# Altium schematic sheet CONNECTORS.SchDoc
size A3; SheetNumber: 3; SheetTotal: 4
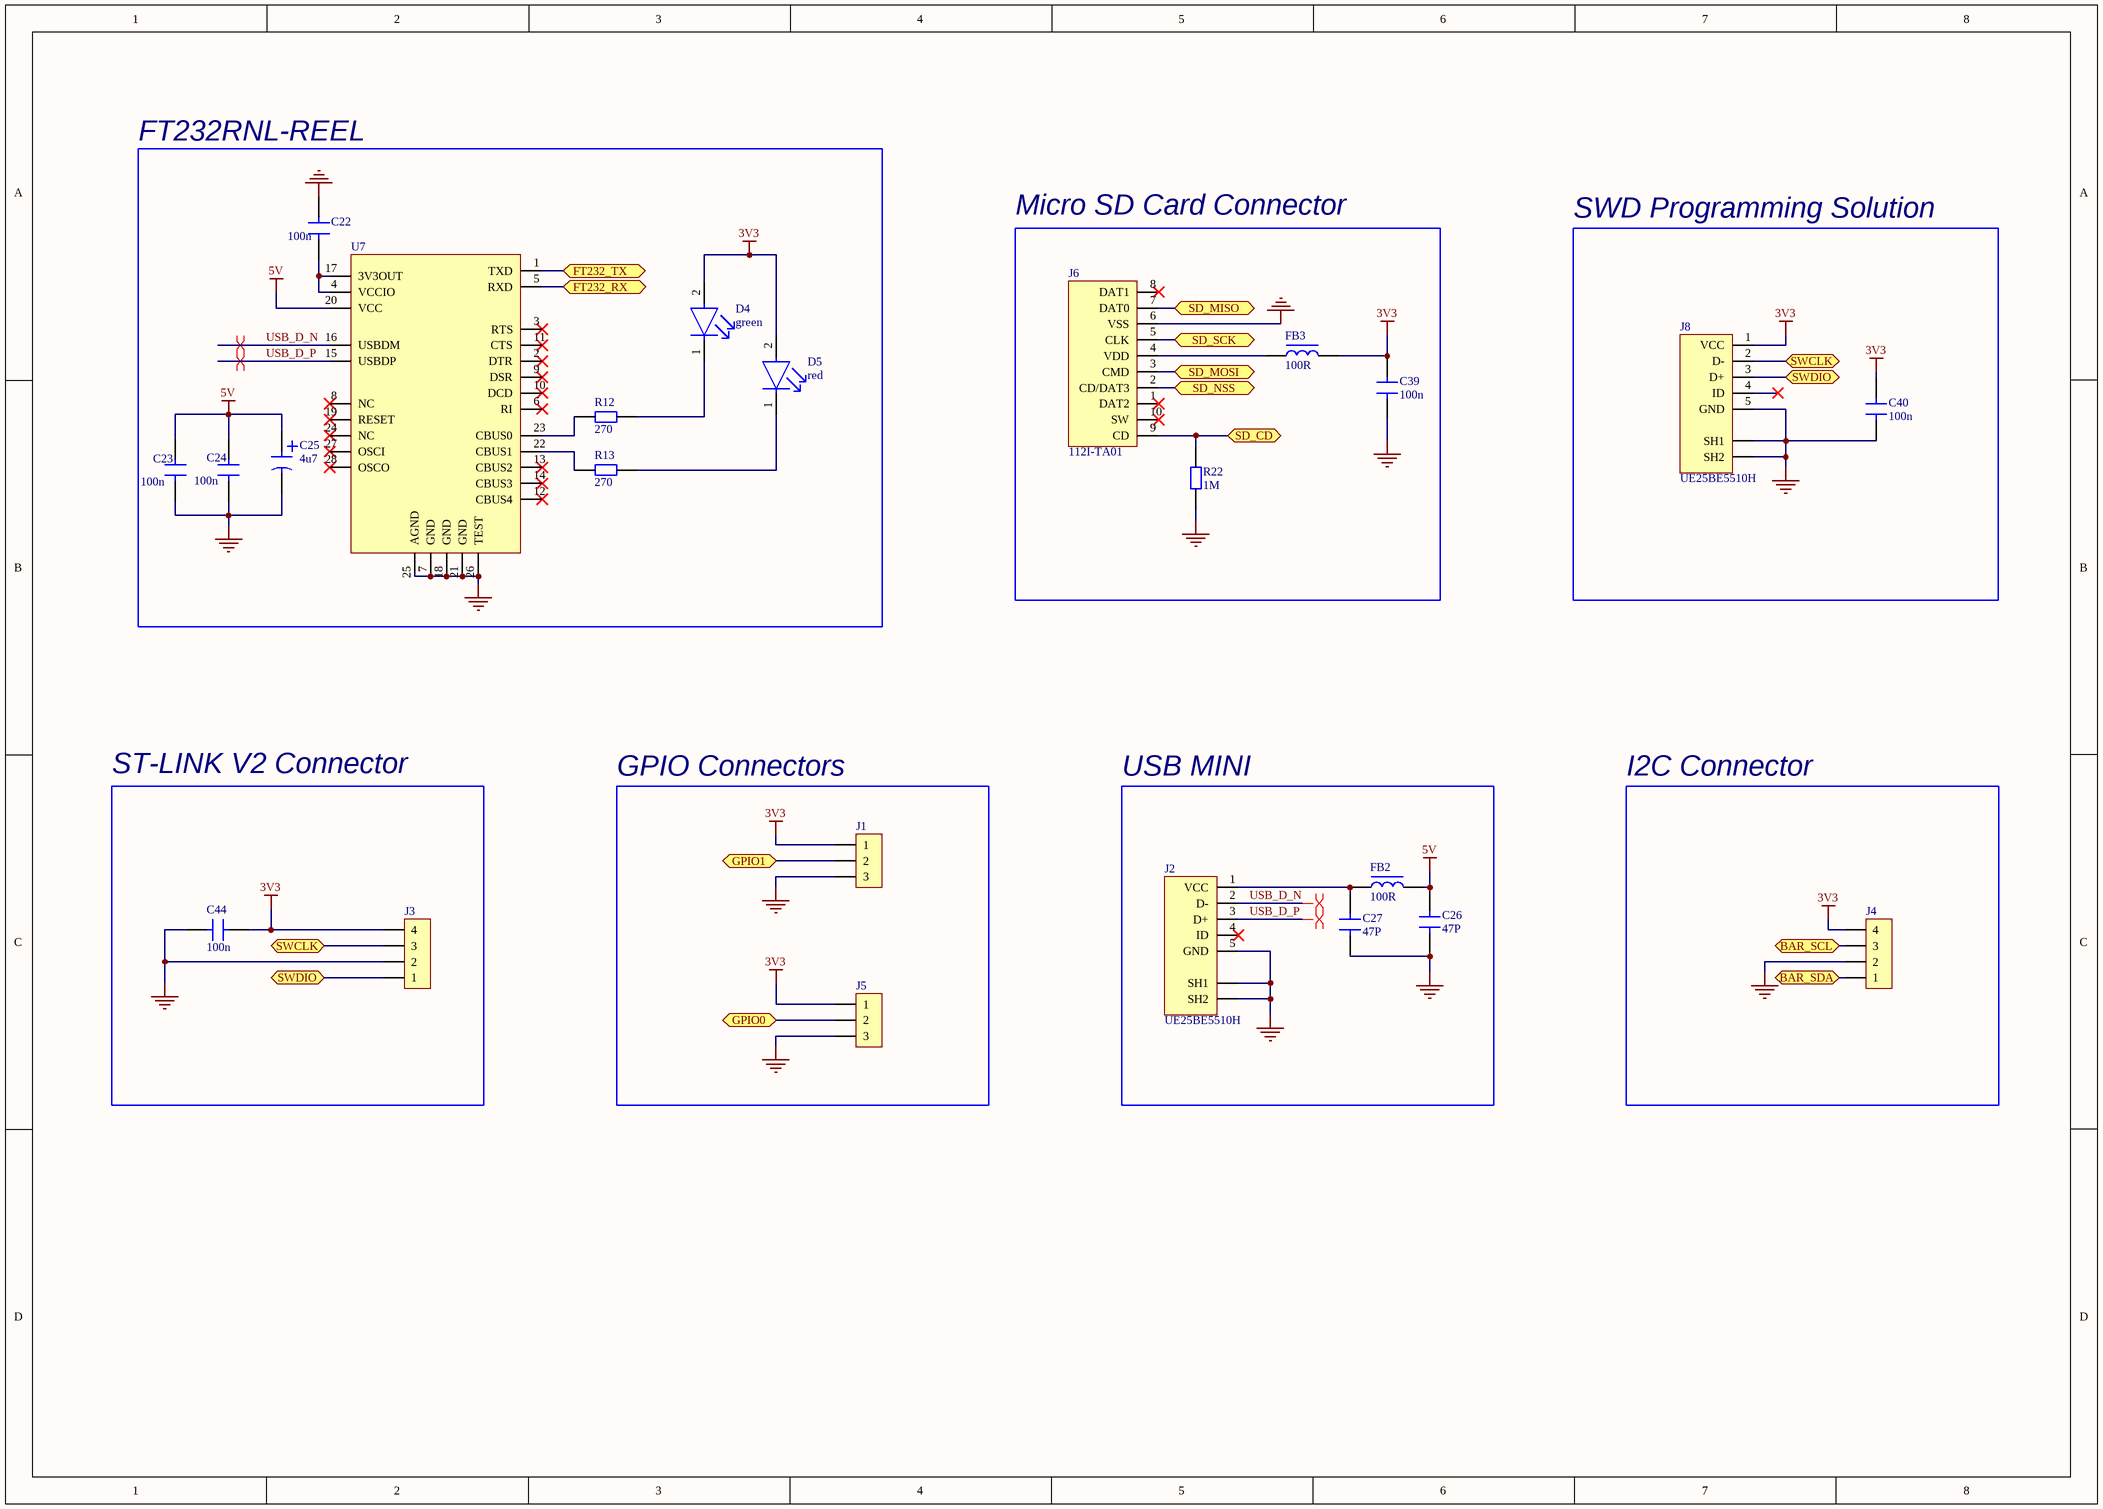
[diagram p0: CONNECTORS.SchDoc]

## Parts
C22  100n  [CAP 0603]
C23  100n  [CAP 0603]
C24  100n  [CAP 0603]
C25  4u7  [865060653010]
C26  47P  [CAP 0805]
C27  47P  [CAP 0805]
C39  100n  [CAP 0603]
C40  100n  [CAP 0603]
C44  100n  [CAP 0603]
D4  green  [FP-LTST-C170GKT-MFG]
D5  red  [FP-LTST-C170GKT-MFG]
FB2  100R  [FB 0805]
FB3  100R  [FB 0603]
J1  JST B3B-XH-A  [JST_B3B-XH-A]  (value not drawn)
J2  UE25BE5510H  [UE25BE55H]
J3  1x4 HEADER MALE  [1X4 HEADER MALE]  (value not drawn)
J4  1x4 HEADER MALE  [1X4 HEADER MALE]  (value not drawn)
J5  JST B3B-XH-A  [JST_B3B-XH-A]  (value not drawn)
J6  112I-TA01  [112I-TA01]
J8  UE25BE5510H  [UE25BE55H]
R12  270  [RES 0805]
R13  270  [RES 0805]
R22  1M  [RES 0603]
U7  FT232RL-REEL  [FT232RL]  (value not drawn)

## Blocks framed on the sheet
FT232RNL-REEL: C22-C25 D4 D5 R12 R13 U7
Micro SD Card Connector: C39 FB3 J6 R22
SWD Programming Solution: C40 J8
ST-LINK V2 Connector: C44 J3
GPIO Connectors: J1 J5
USB MINI: C26 C27 FB2 J2
I2C Connector: J4

## Ports
BAR_SCL (bidir, see MCU[6C], PERIPHERALS[6B]), BAR_SDA (bidir, see MCU[6C], PERIPHERALS[6B]), FT232_RX (bidir, see MCU[4C]), FT232_TX (bidir, see MCU[4B]), GPIO0 (bidir, see MCU[6C]), GPIO1 (bidir, see MCU[6C]), SD_CD (bidir, see MCU[6C]), SD_MISO (bidir, see MCU[4C]), SD_MOSI (bidir, see MCU[6C]), SD_NSS (bidir, see MCU[6B]), SD_SCK (bidir, see MCU[4C]), SWCLK (bidir, see CONNECTORS[2C], MCU[6B]), SWCLK (bidir, see CONNECTORS[7A], MCU[6B]), SWDIO (bidir, see CONNECTORS[2C], MCU[6B]), SWDIO (bidir, see CONNECTORS[7A], MCU[6B])

## Nets
3V3: C39.2 C40.2 C44.2 D4.2(A) D5.2(A) FB3.2 J1.1 J3.4 J4.4 J5.1 J8.1(VCC)
5V: C23.2 C24.2 C25.1(P) C26.2 FB2.2 U7.20(VCC)
GND: C22.2 C23.1 C24.1 C25.2(N) C26.1 C27.1 C39.1 C40.1 C44.1 J1.3 J2.5(GND) J2.SH1 J2.SH2 J3.2 J4.2 J5.3 J6.6(VSS) J8.5(GND) J8.SH1 J8.SH2 R22.1 U7.7(GND) U7.18(GND) U7.21(GND) U7.25(AGND) U7.26(TEST)
BAR_SCL: J4.3 ; port BAR_SCL
BAR_SDA: J4.1 ; port BAR_SDA
FT232_RX: U7.5(RXD) ; port FT232_RX
FT232_TX: U7.1(TXD) ; port FT232_TX
GPIO0: J5.2 ; port GPIO0
GPIO1: J1.2 ; port GPIO1
SD_CD: J6.9(CD) R22.2 ; port SD_CD
SD_MISO: J6.7(DAT0) ; port SD_MISO
SD_MOSI: J6.3(CMD) ; port SD_MOSI
SD_NSS: J6.2(CD/DAT3) ; port SD_NSS
SD_SCK: J6.5(CLK) ; port SD_SCK
SWCLK: J3.3 J8.2(D-) ; port SWCLK
SWDIO: J3.1 J8.3(D+) ; port SWDIO
USB_D_N: J2.2(D-) U7.16(USBDM)
USB_D_P: J2.3(D+) U7.15(USBDP)
NetC22_1: C22.1 U7.4(VCCIO) U7.17(3V3OUT)
NetC27_2: C27.2 FB2.1 J2.1(VCC)
NetD4_1: D4.1(C) R12.1
NetD5_1: D5.1(C) R13.1
NetFB3_1: FB3.1 J6.4(VDD)
NetR12_2: R12.2 U7.23(CBUS0)
NetR13_2: R13.2 U7.22(CBUS1)

Not connected (* = marked no-connect by the designer): J2 4(ID)*; J6 1(DAT2)* 8(DAT1)* 10(SW)*; J8 4(ID)*; U7 2(DTR)* 3(RTS)* 6(RI)* 8(NC)* 9(DSR)* 10(DCD)* 11(CTS)* 12(CBUS4)* 13(CBUS2)* 14(CBUS3)* 19(RESET)* 24(NC)* 27(OSCI)* 28(OSCO)*

## Layout directives
differential pair: USB_D_N, USB_D_P

## Library data of the parts
C22-C24 C39 C40 C44 = CAP 0603 50V: Capacitor SMD 0603 50V
C25 = 865060653010: Aluminum Electrolytic Capacitor, Polarized, Aluminum (wet), 50V, 20% +Tol, 20% -Tol, 100uF, Surface Mount, 3333; Manufacturer: Wurth Electronics; Supplier 1: Farnell; Manufacturer Part Number: 865060653010; RoHS: Yes; Category: Aluminum Electrolytic Capacitors; Stock 1: 176; Pricing 1: 1=0,825, 10=0,63, 50=0,551, 100=0,481, 200=0,427, 500=0,355, 2500=0,348, 5000=0,341 (EUR); ComponentLink1URL: http://www.farnell.com/datasheets/1880078.pdf?src-supplier=Farnell; ComponentLink1Description: http://www.farnell.com/datasheets/1880078.pdf?src-supplier=Farnell; ComponentLink2URL: http://www.farnell.com/datasheets/1880078.pdf?src-supplier=Newark; ComponentLink2Description: http://www.farnell.com/datasheets/1880078.pdf?src-supplier=Newark; ComponentLink3URL: http://www.farnell.com/datasheets/1880078.pdf?src-supplier=Element14; ComponentLink3Description: http://www.farnell.com/datasheets/1880078.pdf?src-supplier=Element14; ComponentLink4URL: https://katalog.we-online.de/pbs/datasheet/865060653010.pdf?src-supplier=Digikey; ComponentLink4Description: https://katalog.we-online.de/pbs/datasheet/865060653010.pdf?src-supplier=Digikey
C26 C27 = CAP 0805 50V: Capacitor SMD 0805 50V
D4 D5 = CMP-1674-00002-6: LED GREEN CLEAR SMD; Dominant Wavelength: 569nm; Lens Style: Diffused; Forward Voltage: 2.1V; Number of Elements: 1; Wavelength: 565nm; Luminous Intensity: 6mcd; Test Current: 10mA; Power Dissipation: 100mW; Reverse Voltage: 5V; Forward Current: 30mA; Viewing Angle: 130°; Lens Color: Colorless; Min Operating Temperature: -55°C; Number of Pins: 2; Max Operating Temperature: 85°C; Color: Green; Radiation Hardening: No; Illumination Color: Green; Case Code (Metric): 2012; Lens Transparency: Clear; Case/Package: 0805; Width: 1.25mm; Case Code (Imperial): 0805; Package Quantity: 1; Height: 1.1mm; Depth: 1.25mm; Length: 2mm; Power Rating: 100mW; Lead Free: Lead Free; Number of LEDs: 1; Packaging: Tape and Reel; Mount: Surface Mount; Voltage: 5V
FB2 = FB 0805: Ferrite Bead SMD 0805
FB3 = FB 0603: Ferrite Bead SMD 0603
J1 J5 = JST B3B-XH-A: Connector Header, XH Series, 3 Position, 2.50mm, Through Hole, Press-Fit, Solder, Natural; Manufacturer Part Number: B3B-XH-A(LF)(SN); Supplier 1: CoreStaff; Manufacturer: JST; RoHS: Yes; Category: Headers and Wire Housings; Stock 1: 2101; Pricing 1: 1=39,94, 10=25,1, 50=21,68, 100=18,25, 500=17,57, 1000=17,12, 2000=16,44, 4000=15,79 (JPY); ComponentLink1URL: https://datasheet.ciiva.com/26894/getdatasheetpartid-640434-26894454.pdf?src-supplier=Verical; ComponentLink1Description: https://datasheet.ciiva.com/26894/getdatasheetpartid-640434-26894454.pdf?src-supplier=Verical; ComponentLink2URL: https://datasheet.ciiva.com/26894/getdatasheetpartid-440399-26894778.pdf?src-supplier=Verical; ComponentLink2Description: https://datasheet.ciiva.com/26894/getdatasheetpartid-440399-26894778.pdf?src-supplier=Verical; ComponentLink3URL: https://datasheet.ciiva.com/11746/0900766b8082653f-11746520.pdf?src-supplier=Rs; ComponentLink3Description: https://datasheet.ciiva.com/11746/0900766b8082653f-11746520.pdf?src-supplier=Rs
J2 J8 = UE25BE5510H: Conn Mini USB 2.0 Type B RCP 5 POS 0.8mm Solder ST Thru-Hole 5 Terminal 1 Port; Manufacturer: Amphenol Commercial; Supplier 1: Arrow Electronics; Manufacturer Part Number: UE25BE5510H; RoHS: Yes; Category: USB Connectors; Stock 1: 16852; Pricing 1: 1=0,4693, 10=0,4507, 25=0,4468, 50=0,4303, 100=0,4157 (USD); ComponentLink1URL: http://www.alliedelec.com/m/d/e7e3d7a920045eebbdef787e60d8b001.pdf?src-supplier=Allied+Electronics; ComponentLink1Description: http://www.alliedelec.com/m/d/e7e3d7a920045eebbdef787e60d8b001.pdf?src-supplier=Allied+Electronics; ComponentLink2URL: https://www.amphenolcanada.com/ProductSearch/drawings/AC/UE25BEX510X.pdf?src-supplier=Digi-Key; ComponentLink2Description: https://www.amphenolcanada.com/ProductSearch/drawings/AC/UE25BEX510X.pdf?src-supplier=Digi-Key; ComponentLink3URL: https://datasheet.octopart.com/UE25-BE55-10H-Amphenol-datasheet-14681365.pdf?src-supplier=Future+Electronics; ComponentLink3Description: https://datasheet.octopart.com/UE25-BE55-10H-Amphenol-datasheet-14681365.pdf?src-supplier=Future+Electronics; ComponentLink4URL: https://datasheet.octopart.com/UE25BE5510H-Amphenol-Communications-Solutions-datasheet-62282189.pdf?src-supplier=Electro+Sonic; ComponentLink4Description: https://datasheet.octopart.com/UE25BE5510H-Amphenol-Communications-Solutions-datasheet-62282189.pdf?src-supplier=Electro+Sonic; Supplier Part Number 1: UE25BE5510H
J6 = 112I-TA01: Micro SD Card Push-Pull 10P (8+2), Switch, Peg, SMD 112I-TA01
R12 R13 = RES 0805: Resistor SMD 0805
R22 = RES 0603: Resistor SMD 0603
U7 = FT232RL-REEL: IC USB FS SERIAL UART 28-SSOP; Manufacturer: FTDI; Interface: UART,RS-232,RS-422,RS-485; Data Rate: 12Mbps; Number of Channels: 1; Max Supply Voltage: 5.25V; Min Supply Voltage: 3.3V; Operating Supply Current: 15mA; Voltage: 5V; Supplier 1: Arrow Electronics; Manufacturer Part Number: FT232RL-REEL; RoHS: Yes; Category: Interface ICs; Stock 1: 3812; Pricing 1: 1=4,75, 10=4,3, 50=4,1 (USD); Mount: Surface Mount; Case/Package: SSOP; Number of Pins: 28; Weight: 0.080001oz; Min Operating Temperature: -40°C; Max Operating Temperature: 85°C; Packaging: Tape and Reel; Series: USBmadeEZ-UART; Package Quantity: 1; Number of Transceivers: 1; Length: 10.2mm; Width: 5.3mm; Height: 1.75mm; Radiation Hardening: No; Lead Free: Lead Free; RoHS Compliant: Yes; Reach SVHC Compliant: No; ComponentLink1URL: https://datasheet.ciiva.com/34304/2161019-34304054.pdf?src-supplier=Jameco; ComponentLink1Description: https://datasheet.ciiva.com/34304/2161019-34304054.pdf?src-supplier=Jameco; ComponentLink2URL: https://datasheet.ciiva.com/4787/ds-ft232r-11534-4787658.pdf?src-supplier=Mouser; ComponentLink2Description: https://datasheet.ciiva.com/4787/ds-ft232r-11534-4787658.pdf?src-supplier=Mouser; ComponentLink3URL: https://datasheet.ciiva.com/1787/ds-ft232r-1787048.pdf?src-supplier=Digikey; ComponentLink3Description: https://datasheet.ciiva.com/1787/ds-ft232r-1787048.pdf?src-supplier=Digikey; ComponentLink4URL: https://datasheet.ciiva.com/1787/ds-ft232r-1787047.pdf?src-supplier=Digikey; ComponentLink4Description: https://datasheet.ciiva.com/1787/ds-ft232r-1787047.pdf?src-supplier=Digikey; ComponentLink5URL: https://datasheet.ciiva.com/1787/ds-ft232r-1787049.pdf?src-supplier=Digikey; ComponentLink5Description: https://datasheet.ciiva.com/1787/ds-ft232r-1787049.pdf?src-supplier=Digikey; ComponentLink6URL: https://datasheet.ciiva.com/16200/ds-ft232r-16200652.pdf?src-supplier=Future+Electronics; ComponentLink6Description: https://datasheet.ciiva.com/16200/ds-ft232r-16200652.pdf?src-supplier=Future+Electronics; ComponentLink7URL: https://datasheet.ciiva.com/15150/getdatasheetpartid-643207-15150506.pdf?src-supplier=Verical; ComponentLink7Description: https://datasheet.ciiva.com/15150/getdatasheetpartid-643207-15150506.pdf?src-supplier=Verical